# EAGLE design APDS-9008 Breakout (EAGLE 6.4)
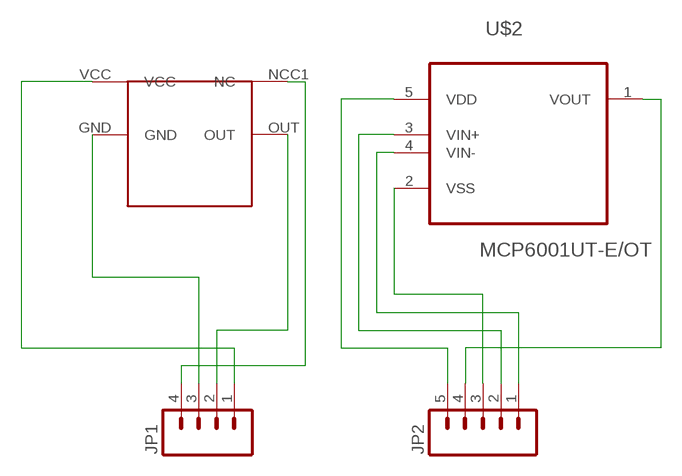
[diagram p0: schematic, sheet 1]

## Parts
JP1  M04LOCK  [1X04_LOCK]
JP2  M05LOCK  [1X05_LOCK]
U$1  APDS9008  [APDS9008]
U$2  MCP6001UT-E/OT  [SOT95P270X145-5N]

## Nets
A-GND: JP1.3 U$1.GND
A-NC: JP1.4 U$1.NCC1(NC)
A-OUT: JP1.2 U$1.OUT
A-VCC: JP1.1 U$1.VCC
M-VDD: JP2.5 U$2.5(VDD)
M-VIN+: JP2.2 U$2.3(VIN+)
M-VIN-: JP2.1 U$2.4(VIN-)
M-VOUT: JP2.4 U$2.1(VOUT)
M-VSS: JP2.3 U$2.2(VSS)

## Library data of the parts
JP1 = SparkFun:M04: Header 4 Standard 4-pin 0.1" header. Use with straight break away headers (SKU : PRT-00116), right angle break away headers (PRT-00553), swiss pins (PRT-00743), machine pins (PRT-00117), and female headers (PRT-00115). Molex polarized connector foot print use with SKU : PRT-08231 with associated crimp pins and housings. 1MM SMD Version SKU: PRT-10208
JP2 = SparkFun:M05: Header 5 Standard 5-pin 0.1" header. Use with straight break away headers (SKU : PRT-00116), right angle break away headers (PRT-00553), swiss pins (PRT-00743), machine pins (PRT-00117), and female headers (PRT-00115). Molex polarized connector foot print use with SKU : PRT-08230 with associated crimp pins and housings.
U$1 = Random parts:APDS9008
U$2 = Random parts:MCP6001UT-E/OT: 1 MHz, Low-Power Op Amp; MPN: MCP6001UT-E/OT; OC_FARNELL: 1840893; OC_NEWARK: 84R5183; PACKAGE: SOT23-5; SUPPLIER: Microchip

## Board
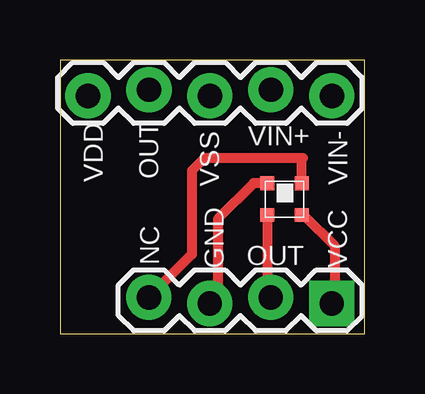
[diagram p1: board, top side]
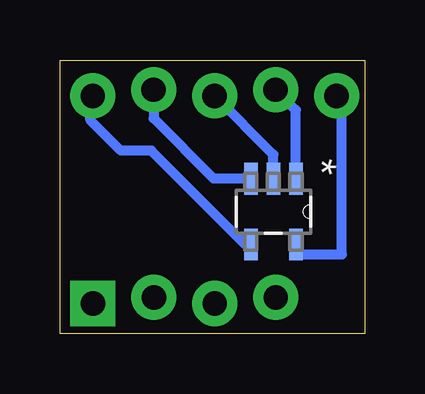
[diagram p2: board, bottom side, seen from below]

Size 12.69 x 11.4 mm. Coordinates in mm from the lower left corner, seen from the top.
Outline: 12.69,0 12.69,11.4 0,11.4 0,0 12.69,0
Copper layers (1*16): Top 0.035mm / dielectric 1.5mm / Bottom 0.035mm
Design rules "default": minimum track width 10mil, minimum drill 24mil, track to track 8mil, track to pad 8mil, pad to pad 8mil, via to via 8mil, smd to smd 8mil, copper to edge 40mil, drill to drill 8mil, minimum pad ring 10mil, minimum via ring 8mil, stop-mask expansion 4mil, vias tented up to drill 0mil, thermal gap 10mil

### Footprints (pad centres in the part's own frame; a part is rotated, then mirrored left to right if it is on the bottom)
1X04_LOCK = drill 1.016 pad 1.88 square: 1 0,0.127 | drill 1.016 pad 1.88: 2 2.54,-0.127; 3 5.08,0.127; 4 7.62,-0.127
1X05_LOCK = drill 1.016 pad 1.88: 1 0,0.127; 2 2.54,-0.127; 3 5.08,0.127; 4 7.62,-0.127; 5 10.16,0.127
APDS9008 = smd 0.577 x 0.577: GND 0.08,-1.52; NCC1 0.08,-0.08; OUT 1.41,-1.52; VCC 1.41,-0.08
SOT95P270X145-5N = smd 1.321 x 0.559: 1 -1.372,0.94; 2 -1.372,0; 3 -1.372,-0.94; 4 1.372,-0.94; 5 1.372,0.94

### Placement (x,y rotation side)
JP1  11.32,1.38 180 top
JP2  11.33,10.03 180 top
U$1  10.15,6.35 270 top
U$2  3.8,5.08 270 bottom

### Tracks (layer width: path | path; a pad name or v marks a point on that pad's centre or on a via)
A-GND
  Top 0.406: U$1.GND 8.06,6.27 6.58,4.78 6.58,1.59 JP1.3
A-NC
  Top 0.406: U$1.NCC1 10.07,7.27 10.12,7.32 6.01,7.32 5.49,6.79 5.49,3.3 JP1.4
A-OUT
  Top 0.406: U$1.OUT 8.63,1.66 JP1.2
A-VCC
  Top 0.406: U$1.VCC 10.16,4.94 11.44,3.66 11.44,1.38 JP1.1
M-VDD
  Bottom 0.406: U$2.5 2.86,3.3 0.95,3.3 0.95,9.91 JP2.5
M-VIN+
  Bottom 0.406: JP2.2 8.79,8.96 6.3,6.47 4.76,6.47 U$2.3
M-VIN-
  Bottom 0.406: U$2.4 4.97,3.71 8.88,7.62 10.15,7.62 11.42,8.89 11.42,9.81 JP2.1
M-VOUT
  Bottom 0.406: U$2.1 2.86,9.31 JP2.4
M-VSS
  Bottom 0.406: U$2.2 3.8,7.46 JP2.3

### Text on the board
_tsilk: VIN+ | VIN- | VDD | OUT | VSS | VCC | NC | GND | OUT